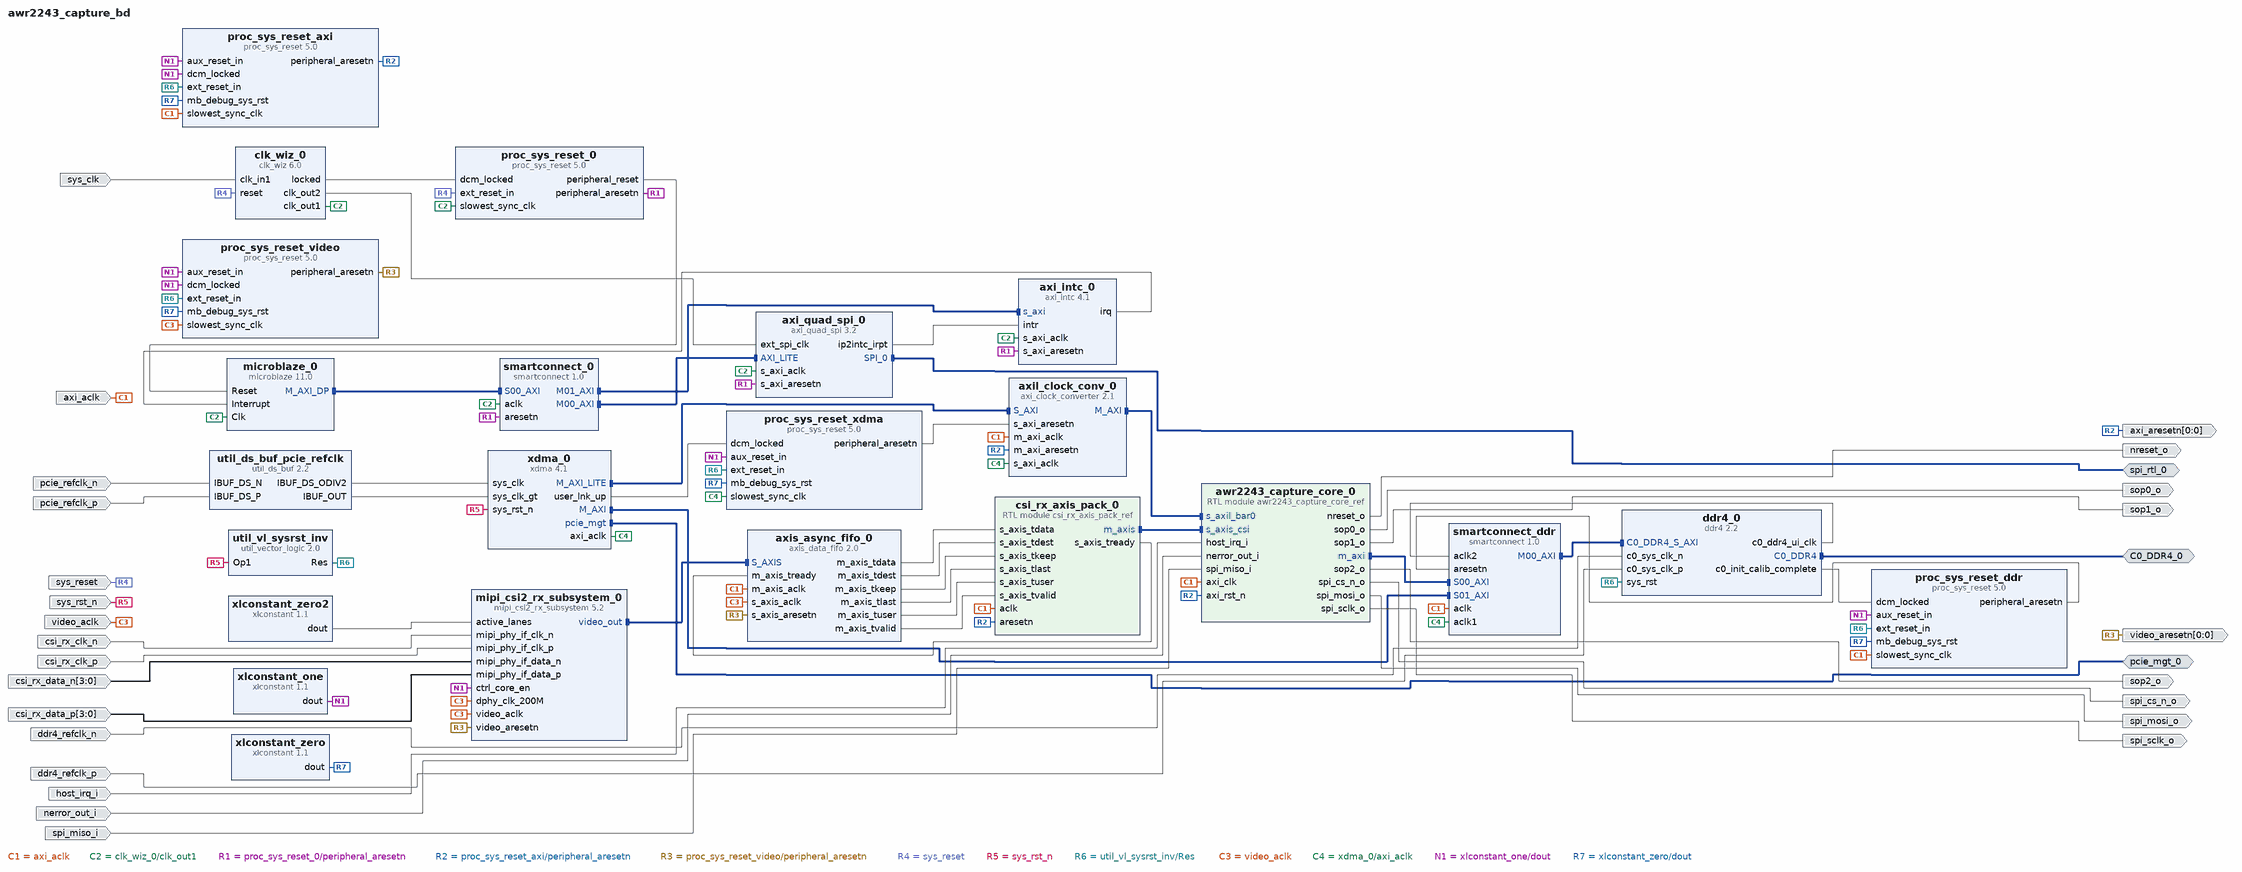
[diagram p0: block diagram of the top level]
# Vivado block design awr2243_capture_bd, xcku5p-ffvb676-2-e, Vivado 2022.2
create_bd_design awr2243_capture_bd

create_bd_intf_port -mode Master -vlnv xilinx.com:interface:ddr4_rtl:1.0 C0_DDR4_0
create_bd_intf_port -mode Master -vlnv xilinx.com:interface:pcie_7x_mgt_rtl:1.0 pcie_mgt_0
create_bd_intf_port -mode Master -vlnv xilinx.com:interface:spi_rtl:1.0 spi_rtl_0
create_bd_port -dir I -type rst sys_rst_n
set_property -dict {CONFIG.POLARITY ACTIVE_LOW} [get_bd_ports sys_rst_n]
create_bd_port -dir I -type clk axi_aclk
set_property -dict {CONFIG.FREQ_HZ 250000000} [get_bd_ports axi_aclk]
create_bd_port -dir O -from 0 -to 0 -type rst video_aresetn
set_property -dict {CONFIG.POLARITY ACTIVE_LOW} [get_bd_ports video_aresetn]
create_bd_port -dir O -from 0 -to 0 -type rst axi_aresetn
set_property -dict {CONFIG.POLARITY ACTIVE_LOW} [get_bd_ports axi_aresetn]
create_bd_port -dir I pcie_refclk_p
create_bd_port -dir I pcie_refclk_n
create_bd_port -dir I ddr4_refclk_p
create_bd_port -dir I ddr4_refclk_n
create_bd_port -dir O spi_sclk_o
create_bd_port -dir O spi_cs_n_o
create_bd_port -dir O spi_mosi_o
create_bd_port -dir I spi_miso_i
create_bd_port -dir O sop0_o
create_bd_port -dir O sop1_o
create_bd_port -dir O sop2_o
create_bd_port -dir O nreset_o
create_bd_port -dir I host_irq_i
create_bd_port -dir I nerror_out_i
create_bd_port -dir I -type clk video_aclk
set_property -dict {CONFIG.FREQ_HZ 200000000} [get_bd_ports video_aclk]
create_bd_port -dir I -from 3 -to 0 csi_rx_data_p
create_bd_port -dir I -from 3 -to 0 csi_rx_data_n
create_bd_port -dir I csi_rx_clk_p
create_bd_port -dir I csi_rx_clk_n
create_bd_port -dir I -type clk sys_clk
set_property -dict {CONFIG.FREQ_HZ 100000000} [get_bd_ports sys_clk]
create_bd_port -dir I -type rst sys_reset
set_property -dict {CONFIG.POLARITY ACTIVE_HIGH} [get_bd_ports sys_reset]

create_bd_cell -type ip -vlnv xilinx.com:ip:util_ds_buf:2.2 util_ds_buf_pcie_refclk
set_property -dict {CONFIG.C_BUF_TYPE IBUFDSGTE} [get_bd_cells util_ds_buf_pcie_refclk]
create_bd_cell -type ip -vlnv xilinx.com:ip:proc_sys_reset:5.0 proc_sys_reset_video
create_bd_cell -type ip -vlnv xilinx.com:ip:proc_sys_reset:5.0 proc_sys_reset_axi
create_bd_cell -type ip -vlnv xilinx.com:ip:proc_sys_reset:5.0 proc_sys_reset_xdma
create_bd_cell -type ip -vlnv xilinx.com:ip:proc_sys_reset:5.0 proc_sys_reset_ddr
create_bd_cell -type ip -vlnv xilinx.com:ip:xlconstant:1.1 xlconstant_one
set_property -dict {CONFIG.CONST_VAL 1 CONFIG.CONST_WIDTH 1} [get_bd_cells xlconstant_one]
create_bd_cell -type ip -vlnv xilinx.com:ip:xlconstant:1.1 xlconstant_zero
set_property -dict {CONFIG.CONST_VAL 0 CONFIG.CONST_WIDTH 1} [get_bd_cells xlconstant_zero]
create_bd_cell -type ip -vlnv xilinx.com:ip:xlconstant:1.1 xlconstant_zero2
set_property -dict {CONFIG.CONST_VAL 0 CONFIG.CONST_WIDTH 2} [get_bd_cells xlconstant_zero2]
create_bd_cell -type ip -vlnv xilinx.com:ip:util_vector_logic:2.0 util_vl_sysrst_inv
set_property -dict {CONFIG.C_OPERATION not CONFIG.C_SIZE 1} [get_bd_cells util_vl_sysrst_inv]
create_bd_cell -type ip -vlnv xilinx.com:ip:xdma:4.1 xdma_0
set_property -dict [list \
  CONFIG.axi_data_width 256_bit \
  CONFIG.axilite_master_en true \
  CONFIG.axilite_master_scale Kilobytes \
  CONFIG.axilite_master_size 64 \
  CONFIG.en_axi_master_if true \
  CONFIG.en_axi_slave_if false \
  CONFIG.pl_link_cap_max_link_speed 8.0_GT/s \
  CONFIG.pl_link_cap_max_link_width X8 \
  CONFIG.xdma_axi_intf_mm AXI_Memory_Mapped \
] [get_bd_cells xdma_0]
create_bd_cell -type ip -vlnv xilinx.com:ip:smartconnect:1.0 smartconnect_ddr
set_property -dict {CONFIG.NUM_CLKS 3 CONFIG.NUM_MI 1 CONFIG.NUM_SI 2} [get_bd_cells smartconnect_ddr]
create_bd_cell -type ip -vlnv xilinx.com:ip:axis_data_fifo:2.0 axis_async_fifo_0
set_property -dict [list \
  CONFIG.FIFO_DEPTH 512 \
  CONFIG.HAS_TKEEP 1 \
  CONFIG.HAS_TLAST 1 \
  CONFIG.IS_ACLK_ASYNC 1 \
  CONFIG.TDATA_NUM_BYTES 8 \
  CONFIG.TDEST_WIDTH 10 \
  CONFIG.TUSER_WIDTH 96 \
] [get_bd_cells axis_async_fifo_0]
create_bd_cell -type module -reference csi_rx_axis_pack_ref csi_rx_axis_pack_0
set_property -dict [list \
  CONFIG.M_DATA_W 256 \
  CONFIG.M_TUSER_W 64 \
  CONFIG.S_DATA_W 64 \
  CONFIG.S_DT_TDEST_LSB 2 \
  CONFIG.S_ERR_BIT 1 \
  CONFIG.S_PAYLOAD_LEN_LSB 48 \
  CONFIG.S_TDEST_W 10 \
  CONFIG.S_TUSER_W 96 \
  CONFIG.S_VC_TDEST_LSB 0 \
] [get_bd_cells csi_rx_axis_pack_0]
create_bd_cell -type module -reference awr2243_capture_core_ref awr2243_capture_core_0
set_property -dict [list \
  CONFIG.AXIL_ADDR_W 32 \
  CONFIG.AXIL_DATA_W 32 \
  CONFIG.AXIS_DATA_W 256 \
  CONFIG.AXIS_USER_W 64 \
  CONFIG.AXI_ADDR_W 34 \
  CONFIG.AXI_DATA_W 256 \
] [get_bd_cells awr2243_capture_core_0]
create_bd_cell -type ip -vlnv xilinx.com:ip:axi_clock_converter:2.1 axil_clock_conv_0
set_property -dict {CONFIG.ADDR_WIDTH 32 CONFIG.DATA_WIDTH 32 CONFIG.PROTOCOL AXI4LITE} [get_bd_cells axil_clock_conv_0]
create_bd_cell -type ip -vlnv xilinx.com:ip:ddr4:2.2 ddr4_0
set_property -dict {CONFIG.C0.DDR4_DataWidth 64 CONFIG.C0.DDR4_InputClockPeriod 10000} [get_bd_cells ddr4_0]
create_bd_cell -type ip -vlnv xilinx.com:ip:mipi_csi2_rx_subsystem:5.2 mipi_csi2_rx_subsystem_0
set_property -dict [list \
  CONFIG.AXIS_TDATA_WIDTH 64 \
  CONFIG.AXIS_TDEST_WIDTH 10 \
  CONFIG.CMN_INC_VFB false \
  CONFIG.CMN_NUM_LANES 4 \
  CONFIG.CSI_CONTROLLER_REG_IF false \
  CONFIG.C_DPHY_LANES 4 \
  CONFIG.C_HS_LINE_RATE 600 \
  CONFIG.DPY_LINE_RATE 600 \
  CONFIG.SupportLevel 1 \
] [get_bd_cells mipi_csi2_rx_subsystem_0]
create_bd_cell -type ip -vlnv xilinx.com:ip:microblaze:11.0 microblaze_0
set_property -dict [list \
  CONFIG.C_DIV_ZERO_EXCEPTION 1 \
  CONFIG.C_USE_DCACHE 0 \
  CONFIG.C_USE_ICACHE 0 \
  CONFIG.G_TEMPLATE_LIST 2 \
  CONFIG.G_USE_EXCEPTIONS 1 \
] [get_bd_cells microblaze_0]
create_bd_cell -type ip -vlnv xilinx.com:ip:axi_quad_spi:3.2 axi_quad_spi_0
set_property -dict {CONFIG.C_BYTE_LEVEL_INTERRUPT_EN 0 CONFIG.C_NUM_TRANSFER_BITS 16} [get_bd_cells axi_quad_spi_0]
create_bd_cell -type ip -vlnv xilinx.com:ip:smartconnect:1.0 smartconnect_0
set_property -dict {CONFIG.NUM_MI 2 CONFIG.NUM_SI 1} [get_bd_cells smartconnect_0]
create_bd_cell -type ip -vlnv xilinx.com:ip:clk_wiz:6.0 clk_wiz_0
set_property -dict [list \
  CONFIG.CLKIN2_JITTER_PS 100.0 \
  CONFIG.CLKOUT2_JITTER 120.663 \
  CONFIG.CLKOUT2_PHASE_ERROR 87.180 \
  CONFIG.CLKOUT2_REQUESTED_OUT_FREQ 80 \
  CONFIG.CLKOUT2_USED true \
  CONFIG.MMCM_CLKIN2_PERIOD 12.500 \
  CONFIG.MMCM_CLKOUT1_DIVIDE 15 \
  CONFIG.NUM_OUT_CLKS 2 \
  CONFIG.SECONDARY_SOURCE Single_ended_clock_capable_pin \
  CONFIG.USE_INCLK_SWITCHOVER false \
] [get_bd_cells clk_wiz_0]
create_bd_cell -type ip -vlnv xilinx.com:ip:proc_sys_reset:5.0 proc_sys_reset_0
create_bd_cell -type ip -vlnv xilinx.com:ip:axi_intc:4.1 axi_intc_0

# ---- connections ----

connect_bd_intf_net [get_bd_intf_pins smartconnect_ddr/S00_AXI] [get_bd_intf_pins awr2243_capture_core_0/m_axi]
connect_bd_intf_net [get_bd_intf_ports spi_rtl_0] [get_bd_intf_pins axi_quad_spi_0/SPI_0]
connect_bd_intf_net [get_bd_intf_pins axil_clock_conv_0/M_AXI] [get_bd_intf_pins awr2243_capture_core_0/s_axil_bar0]
connect_bd_intf_net [get_bd_intf_pins csi_rx_axis_pack_0/m_axis] [get_bd_intf_pins awr2243_capture_core_0/s_axis_csi]
connect_bd_intf_net [get_bd_intf_ports C0_DDR4_0] [get_bd_intf_pins ddr4_0/C0_DDR4]
connect_bd_intf_net [get_bd_intf_pins smartconnect_0/S00_AXI] [get_bd_intf_pins microblaze_0/M_AXI_DP]
connect_bd_intf_net [get_bd_intf_pins mipi_csi2_rx_subsystem_0/video_out] [get_bd_intf_pins axis_async_fifo_0/S_AXIS]
connect_bd_intf_net [get_bd_intf_pins smartconnect_0/M00_AXI] [get_bd_intf_pins axi_quad_spi_0/AXI_LITE]
connect_bd_intf_net [get_bd_intf_pins smartconnect_0/M01_AXI] [get_bd_intf_pins axi_intc_0/s_axi]
connect_bd_intf_net [get_bd_intf_pins smartconnect_ddr/M00_AXI] [get_bd_intf_pins ddr4_0/C0_DDR4_S_AXI]
connect_bd_intf_net [get_bd_intf_pins xdma_0/M_AXI] [get_bd_intf_pins smartconnect_ddr/S01_AXI]
connect_bd_intf_net [get_bd_intf_pins xdma_0/M_AXI_LITE] [get_bd_intf_pins axil_clock_conv_0/S_AXI]
connect_bd_intf_net [get_bd_intf_ports pcie_mgt_0] [get_bd_intf_pins xdma_0/pcie_mgt]
connect_bd_net [get_bd_pins awr2243_capture_core_0/nreset_o] [get_bd_ports nreset_o]
connect_bd_net [get_bd_pins awr2243_capture_core_0/sop0_o] [get_bd_ports sop0_o]
connect_bd_net [get_bd_pins awr2243_capture_core_0/sop1_o] [get_bd_ports sop1_o]
connect_bd_net [get_bd_pins awr2243_capture_core_0/sop2_o] [get_bd_ports sop2_o]
connect_bd_net [get_bd_pins awr2243_capture_core_0/spi_cs_n_o] [get_bd_ports spi_cs_n_o]
connect_bd_net [get_bd_pins awr2243_capture_core_0/spi_mosi_o] [get_bd_ports spi_mosi_o]
connect_bd_net [get_bd_pins awr2243_capture_core_0/spi_sclk_o] [get_bd_ports spi_sclk_o]
connect_bd_net [get_bd_ports axi_aclk] \
  [get_bd_pins proc_sys_reset_axi/slowest_sync_clk] [get_bd_pins axil_clock_conv_0/m_axi_aclk] \
  [get_bd_pins axis_async_fifo_0/m_axis_aclk] [get_bd_pins csi_rx_axis_pack_0/aclk] \
  [get_bd_pins awr2243_capture_core_0/axi_clk] [get_bd_pins smartconnect_ddr/aclk] \
  [get_bd_pins proc_sys_reset_ddr/slowest_sync_clk]
connect_bd_net [get_bd_pins axi_intc_0/irq] [get_bd_pins microblaze_0/Interrupt]
connect_bd_net [get_bd_pins axi_quad_spi_0/ip2intc_irpt] [get_bd_pins axi_intc_0/intr]
connect_bd_net [get_bd_pins axis_async_fifo_0/m_axis_tdata] [get_bd_pins csi_rx_axis_pack_0/s_axis_tdata]
connect_bd_net [get_bd_pins axis_async_fifo_0/m_axis_tdest] [get_bd_pins csi_rx_axis_pack_0/s_axis_tdest]
connect_bd_net [get_bd_pins axis_async_fifo_0/m_axis_tkeep] [get_bd_pins csi_rx_axis_pack_0/s_axis_tkeep]
connect_bd_net [get_bd_pins axis_async_fifo_0/m_axis_tlast] [get_bd_pins csi_rx_axis_pack_0/s_axis_tlast]
connect_bd_net [get_bd_pins axis_async_fifo_0/m_axis_tuser] [get_bd_pins csi_rx_axis_pack_0/s_axis_tuser]
connect_bd_net [get_bd_pins axis_async_fifo_0/m_axis_tvalid] [get_bd_pins csi_rx_axis_pack_0/s_axis_tvalid]
connect_bd_net [get_bd_pins clk_wiz_0/clk_out1] \
  [get_bd_pins microblaze_0/Clk] [get_bd_pins smartconnect_0/aclk] [get_bd_pins axi_quad_spi_0/s_axi_aclk] \
  [get_bd_pins proc_sys_reset_0/slowest_sync_clk] [get_bd_pins axi_intc_0/s_axi_aclk]
connect_bd_net [get_bd_pins clk_wiz_0/clk_out2] [get_bd_pins axi_quad_spi_0/ext_spi_clk]
connect_bd_net [get_bd_pins clk_wiz_0/locked] [get_bd_pins proc_sys_reset_0/dcm_locked]
connect_bd_net [get_bd_pins csi_rx_axis_pack_0/s_axis_tready] [get_bd_pins axis_async_fifo_0/m_axis_tready]
connect_bd_net [get_bd_ports csi_rx_clk_n] [get_bd_pins mipi_csi2_rx_subsystem_0/mipi_phy_if_clk_n]
connect_bd_net [get_bd_ports csi_rx_clk_p] [get_bd_pins mipi_csi2_rx_subsystem_0/mipi_phy_if_clk_p]
connect_bd_net [get_bd_ports csi_rx_data_n] [get_bd_pins mipi_csi2_rx_subsystem_0/mipi_phy_if_data_n]
connect_bd_net [get_bd_ports csi_rx_data_p] [get_bd_pins mipi_csi2_rx_subsystem_0/mipi_phy_if_data_p]
connect_bd_net [get_bd_pins ddr4_0/c0_ddr4_ui_clk] [get_bd_pins smartconnect_ddr/aclk2]
connect_bd_net [get_bd_pins ddr4_0/c0_init_calib_complete] [get_bd_pins proc_sys_reset_ddr/dcm_locked]
connect_bd_net [get_bd_ports ddr4_refclk_n] [get_bd_pins ddr4_0/c0_sys_clk_n]
connect_bd_net [get_bd_ports ddr4_refclk_p] [get_bd_pins ddr4_0/c0_sys_clk_p]
connect_bd_net [get_bd_ports host_irq_i] [get_bd_pins awr2243_capture_core_0/host_irq_i]
connect_bd_net [get_bd_ports nerror_out_i] [get_bd_pins awr2243_capture_core_0/nerror_out_i]
connect_bd_net [get_bd_ports pcie_refclk_n] [get_bd_pins util_ds_buf_pcie_refclk/IBUF_DS_N]
connect_bd_net [get_bd_ports pcie_refclk_p] [get_bd_pins util_ds_buf_pcie_refclk/IBUF_DS_P]
connect_bd_net [get_bd_pins proc_sys_reset_0/peripheral_aresetn] \
  [get_bd_pins smartconnect_0/aresetn] [get_bd_pins axi_quad_spi_0/s_axi_aresetn] [get_bd_pins axi_intc_0/s_axi_aresetn]
connect_bd_net [get_bd_pins proc_sys_reset_0/peripheral_reset] [get_bd_pins microblaze_0/Reset]
connect_bd_net [get_bd_pins proc_sys_reset_axi/peripheral_aresetn] \
  [get_bd_ports axi_aresetn] [get_bd_pins axil_clock_conv_0/m_axi_aresetn] [get_bd_pins csi_rx_axis_pack_0/aresetn] \
  [get_bd_pins awr2243_capture_core_0/axi_rst_n]
connect_bd_net [get_bd_pins proc_sys_reset_ddr/peripheral_aresetn] [get_bd_pins smartconnect_ddr/aresetn]
connect_bd_net [get_bd_pins proc_sys_reset_video/peripheral_aresetn] \
  [get_bd_ports video_aresetn] [get_bd_pins mipi_csi2_rx_subsystem_0/video_aresetn] \
  [get_bd_pins axis_async_fifo_0/s_axis_aresetn]
connect_bd_net [get_bd_pins proc_sys_reset_xdma/peripheral_aresetn] [get_bd_pins axil_clock_conv_0/s_axi_aresetn]
connect_bd_net [get_bd_ports spi_miso_i] [get_bd_pins awr2243_capture_core_0/spi_miso_i]
connect_bd_net [get_bd_ports sys_clk] [get_bd_pins clk_wiz_0/clk_in1]
connect_bd_net [get_bd_ports sys_reset] [get_bd_pins clk_wiz_0/reset] [get_bd_pins proc_sys_reset_0/ext_reset_in]
connect_bd_net [get_bd_ports sys_rst_n] [get_bd_pins util_vl_sysrst_inv/Op1] [get_bd_pins xdma_0/sys_rst_n]
connect_bd_net [get_bd_pins util_ds_buf_pcie_refclk/IBUF_DS_ODIV2] [get_bd_pins xdma_0/sys_clk]
connect_bd_net [get_bd_pins util_ds_buf_pcie_refclk/IBUF_OUT] [get_bd_pins xdma_0/sys_clk_gt]
connect_bd_net [get_bd_pins util_vl_sysrst_inv/Res] \
  [get_bd_pins proc_sys_reset_video/ext_reset_in] [get_bd_pins proc_sys_reset_axi/ext_reset_in] \
  [get_bd_pins proc_sys_reset_xdma/ext_reset_in] [get_bd_pins proc_sys_reset_ddr/ext_reset_in] [get_bd_pins ddr4_0/sys_rst]
connect_bd_net [get_bd_ports video_aclk] \
  [get_bd_pins proc_sys_reset_video/slowest_sync_clk] [get_bd_pins mipi_csi2_rx_subsystem_0/video_aclk] \
  [get_bd_pins mipi_csi2_rx_subsystem_0/dphy_clk_200M] [get_bd_pins axis_async_fifo_0/s_axis_aclk]
connect_bd_net [get_bd_pins xdma_0/axi_aclk] \
  [get_bd_pins proc_sys_reset_xdma/slowest_sync_clk] [get_bd_pins axil_clock_conv_0/s_axi_aclk] \
  [get_bd_pins smartconnect_ddr/aclk1]
connect_bd_net [get_bd_pins xdma_0/user_lnk_up] [get_bd_pins proc_sys_reset_xdma/dcm_locked]
connect_bd_net [get_bd_pins xlconstant_one/dout] \
  [get_bd_pins proc_sys_reset_video/aux_reset_in] [get_bd_pins proc_sys_reset_axi/aux_reset_in] \
  [get_bd_pins proc_sys_reset_xdma/aux_reset_in] [get_bd_pins proc_sys_reset_ddr/aux_reset_in] \
  [get_bd_pins proc_sys_reset_video/dcm_locked] [get_bd_pins proc_sys_reset_axi/dcm_locked] \
  [get_bd_pins mipi_csi2_rx_subsystem_0/ctrl_core_en]
connect_bd_net [get_bd_pins xlconstant_zero2/dout] [get_bd_pins mipi_csi2_rx_subsystem_0/active_lanes]
connect_bd_net [get_bd_pins xlconstant_zero/dout] \
  [get_bd_pins proc_sys_reset_video/mb_debug_sys_rst] [get_bd_pins proc_sys_reset_axi/mb_debug_sys_rst] \
  [get_bd_pins proc_sys_reset_xdma/mb_debug_sys_rst] [get_bd_pins proc_sys_reset_ddr/mb_debug_sys_rst]

# ---- address map ----
assign_bd_address -offset 0x000000000 -range 4G -target_address_space [get_bd_addr_spaces awr2243_capture_core_0/m_axi] [get_bd_addr_segs ddr4_0/C0_DDR4_MEMORY_MAP/C0_DDR4_ADDRESS_BLOCK]
assign_bd_address -offset 0x41200000 -range 64K -target_address_space [get_bd_addr_spaces microblaze_0/Data] [get_bd_addr_segs axi_intc_0/S_AXI/Reg]
assign_bd_address -offset 0x44A00000 -range 64K -target_address_space [get_bd_addr_spaces microblaze_0/Data] [get_bd_addr_segs axi_quad_spi_0/AXI_LITE/Reg]
assign_bd_address -offset 0x0000000000000000 -range 4G -target_address_space [get_bd_addr_spaces xdma_0/M_AXI] [get_bd_addr_segs ddr4_0/C0_DDR4_MEMORY_MAP/C0_DDR4_ADDRESS_BLOCK]
assign_bd_address -offset 0x00000000 -range 4G -target_address_space [get_bd_addr_spaces xdma_0/M_AXI_LITE] [get_bd_addr_segs awr2243_capture_core_0/s_axil_bar0/reg0]

validate_bd_design
save_bd_design
